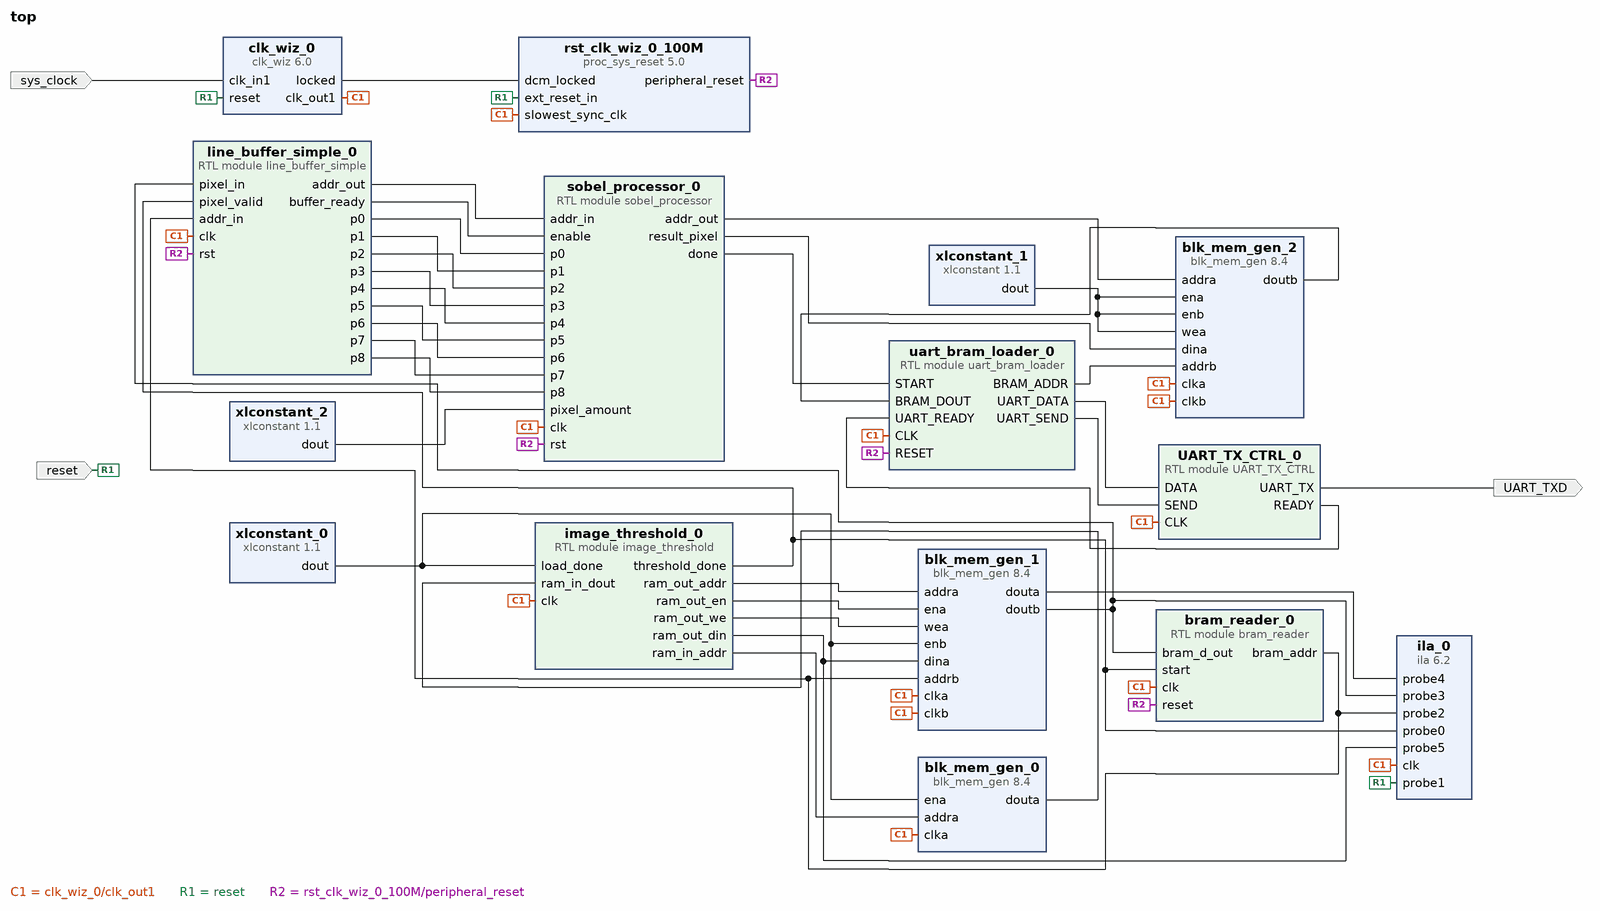
[diagram p0: block diagram of the top level]
# Vivado block design top, xc7a35tcpg236-1, Vivado 2023.2
create_bd_design top

create_bd_port -dir I -type clk sys_clock
set_property -dict {CONFIG.FREQ_HZ 100000000 CONFIG.PHASE 0.0} [get_bd_ports sys_clock]
create_bd_port -dir O UART_TXD
create_bd_port -dir I -type rst reset
set_property -dict {CONFIG.POLARITY ACTIVE_HIGH} [get_bd_ports reset]

create_bd_cell -type ip -vlnv xilinx.com:ip:clk_wiz:6.0 clk_wiz_0
set_property -dict [list \
  CONFIG.CLKOUT1_JITTER 151.636 \
  CONFIG.CLKOUT1_REQUESTED_OUT_FREQ 50 \
  CONFIG.CLK_IN1_BOARD_INTERFACE sys_clock \
  CONFIG.MMCM_CLKOUT0_DIVIDE_F 20.000 \
  CONFIG.RESET_BOARD_INTERFACE reset \
  CONFIG.USE_BOARD_FLOW true \
] [get_bd_cells clk_wiz_0]
create_bd_cell -type ip -vlnv xilinx.com:ip:blk_mem_gen:8.4 blk_mem_gen_0
set_property -dict [list \
  CONFIG.Coe_File ../../../../../../pepe_8b.coe \
  CONFIG.Load_Init_File true \
  CONFIG.Memory_Type Single_Port_ROM \
  CONFIG.Write_Depth_A 1024 \
  CONFIG.Write_Width_A 8 \
  CONFIG.use_bram_block Stand_Alone \
] [get_bd_cells blk_mem_gen_0]
create_bd_cell -type module -reference image_threshold image_threshold_0
create_bd_cell -type ip -vlnv xilinx.com:ip:blk_mem_gen:8.4 blk_mem_gen_1
set_property -dict [list \
  CONFIG.Assume_Synchronous_Clk false \
  CONFIG.Memory_Type True_Dual_Port_RAM \
  CONFIG.Use_Byte_Write_Enable false \
  CONFIG.Write_Depth_A 1024 \
  CONFIG.Write_Width_A 8 \
  CONFIG.use_bram_block Stand_Alone \
] [get_bd_cells blk_mem_gen_1]
create_bd_cell -type ip -vlnv xilinx.com:ip:proc_sys_reset:5.0 rst_clk_wiz_0_100M
set_property -dict {CONFIG.RESET_BOARD_INTERFACE reset CONFIG.USE_BOARD_FLOW true} [get_bd_cells rst_clk_wiz_0_100M]
create_bd_cell -type ip -vlnv xilinx.com:ip:xlconstant:1.1 xlconstant_0
create_bd_cell -type module -reference sobel_processor sobel_processor_0
create_bd_cell -type ip -vlnv xilinx.com:ip:xlconstant:1.1 xlconstant_2
set_property -dict {CONFIG.CONST_VAL 1023 CONFIG.CONST_WIDTH 10} [get_bd_cells xlconstant_2]
create_bd_cell -type ip -vlnv xilinx.com:ip:blk_mem_gen:8.4 blk_mem_gen_2
set_property -dict [list \
  CONFIG.Assume_Synchronous_Clk true \
  CONFIG.Enable_B Use_ENB_Pin \
  CONFIG.Memory_Type True_Dual_Port_RAM \
  CONFIG.Operating_Mode_A WRITE_FIRST \
  CONFIG.Operating_Mode_B WRITE_FIRST \
  CONFIG.Write_Depth_A 1024 \
  CONFIG.Write_Width_A 8 \
  CONFIG.use_bram_block Stand_Alone \
] [get_bd_cells blk_mem_gen_2]
create_bd_cell -type module -reference UART_TX_CTRL UART_TX_CTRL_0
create_bd_cell -type ip -vlnv xilinx.com:ip:xlconstant:1.1 xlconstant_1
create_bd_cell -type module -reference uart_bram_loader uart_bram_loader_0
create_bd_cell -type ip -vlnv xilinx.com:ip:ila:6.2 ila_0
set_property -dict [list \
  CONFIG.ALL_PROBE_SAME_MU_CNT 4 \
  CONFIG.C_DATA_DEPTH 4096 \
  CONFIG.C_MONITOR_TYPE Native \
  CONFIG.C_NUM_OF_PROBES 6 \
  CONFIG.C_PROBE2_WIDTH 10 \
  CONFIG.C_PROBE3_WIDTH 8 \
  CONFIG.C_PROBE4_WIDTH 8 \
  CONFIG.C_PROBE5_WIDTH 8 \
  CONFIG.C_PROBE6_WIDTH 1 \
  CONFIG.C_PROBE7_WIDTH 1 \
] [get_bd_cells ila_0]
create_bd_cell -type module -reference line_buffer_simple line_buffer_simple_0
create_bd_cell -type module -reference bram_reader bram_reader_0

# ---- connections ----

connect_bd_net [get_bd_pins UART_TX_CTRL_0/READY] [get_bd_pins uart_bram_loader_0/UART_READY]
connect_bd_net [get_bd_pins UART_TX_CTRL_0/UART_TX] [get_bd_ports UART_TXD]
connect_bd_net [get_bd_pins blk_mem_gen_0/douta] [get_bd_pins image_threshold_0/ram_in_dout]
connect_bd_net [get_bd_pins blk_mem_gen_1/douta] [get_bd_pins ila_0/probe4]
connect_bd_net [get_bd_pins blk_mem_gen_1/doutb] \
  [get_bd_pins ila_0/probe3] [get_bd_pins bram_reader_0/bram_d_out] [get_bd_pins line_buffer_simple_0/pixel_in]
connect_bd_net [get_bd_pins blk_mem_gen_2/doutb] [get_bd_pins uart_bram_loader_0/BRAM_DOUT]
connect_bd_net [get_bd_pins clk_wiz_0/clk_out1] \
  [get_bd_pins rst_clk_wiz_0_100M/slowest_sync_clk] [get_bd_pins blk_mem_gen_1/clkb] [get_bd_pins blk_mem_gen_1/clka] \
  [get_bd_pins blk_mem_gen_0/clka] [get_bd_pins blk_mem_gen_2/clka] [get_bd_pins blk_mem_gen_2/clkb] \
  [get_bd_pins uart_bram_loader_0/CLK] [get_bd_pins ila_0/clk] [get_bd_pins UART_TX_CTRL_0/CLK] \
  [get_bd_pins bram_reader_0/clk] [get_bd_pins line_buffer_simple_0/clk] [get_bd_pins image_threshold_0/clk] \
  [get_bd_pins sobel_processor_0/clk]
connect_bd_net [get_bd_pins clk_wiz_0/locked] [get_bd_pins rst_clk_wiz_0_100M/dcm_locked]
connect_bd_net [get_bd_pins image_threshold_0/ram_in_addr] [get_bd_pins blk_mem_gen_0/addra]
connect_bd_net [get_bd_pins image_threshold_0/ram_out_addr] [get_bd_pins blk_mem_gen_1/addra]
connect_bd_net [get_bd_pins image_threshold_0/ram_out_din] [get_bd_pins blk_mem_gen_1/dina] [get_bd_pins ila_0/probe5]
connect_bd_net [get_bd_pins image_threshold_0/ram_out_en] [get_bd_pins blk_mem_gen_1/ena]
connect_bd_net [get_bd_pins image_threshold_0/ram_out_we] [get_bd_pins blk_mem_gen_1/wea]
connect_bd_net [get_bd_pins image_threshold_0/threshold_done] \
  [get_bd_pins ila_0/probe0] [get_bd_pins bram_reader_0/start] [get_bd_pins line_buffer_simple_0/pixel_valid]
connect_bd_net [get_bd_pins line_buffer_simple_0/addr_out] [get_bd_pins sobel_processor_0/addr_in]
connect_bd_net -net line_buffer_simple_0_bram_addr [get_bd_pins bram_reader_0/bram_addr] \
  [get_bd_pins ila_0/probe2] [get_bd_pins blk_mem_gen_1/addrb] [get_bd_pins line_buffer_simple_0/addr_in]
connect_bd_net [get_bd_pins line_buffer_simple_0/buffer_ready] [get_bd_pins sobel_processor_0/enable]
connect_bd_net [get_bd_pins line_buffer_simple_0/p0] [get_bd_pins sobel_processor_0/p0]
connect_bd_net [get_bd_pins line_buffer_simple_0/p1] [get_bd_pins sobel_processor_0/p1]
connect_bd_net [get_bd_pins line_buffer_simple_0/p2] [get_bd_pins sobel_processor_0/p2]
connect_bd_net [get_bd_pins line_buffer_simple_0/p3] [get_bd_pins sobel_processor_0/p3]
connect_bd_net [get_bd_pins line_buffer_simple_0/p4] [get_bd_pins sobel_processor_0/p4]
connect_bd_net [get_bd_pins line_buffer_simple_0/p5] [get_bd_pins sobel_processor_0/p5]
connect_bd_net [get_bd_pins line_buffer_simple_0/p6] [get_bd_pins sobel_processor_0/p6]
connect_bd_net [get_bd_pins line_buffer_simple_0/p7] [get_bd_pins sobel_processor_0/p7]
connect_bd_net [get_bd_pins line_buffer_simple_0/p8] [get_bd_pins sobel_processor_0/p8]
connect_bd_net [get_bd_ports reset] [get_bd_pins rst_clk_wiz_0_100M/ext_reset_in] [get_bd_pins clk_wiz_0/reset] [get_bd_pins ila_0/probe1]
connect_bd_net [get_bd_pins rst_clk_wiz_0_100M/peripheral_reset] \
  [get_bd_pins uart_bram_loader_0/RESET] [get_bd_pins bram_reader_0/reset] [get_bd_pins line_buffer_simple_0/rst] \
  [get_bd_pins sobel_processor_0/rst]
connect_bd_net [get_bd_pins sobel_processor_0/addr_out] [get_bd_pins blk_mem_gen_2/addra]
connect_bd_net [get_bd_pins sobel_processor_0/done] [get_bd_pins uart_bram_loader_0/START]
connect_bd_net [get_bd_pins sobel_processor_0/result_pixel] [get_bd_pins blk_mem_gen_2/dina]
connect_bd_net [get_bd_ports sys_clock] [get_bd_pins clk_wiz_0/clk_in1]
connect_bd_net [get_bd_pins uart_bram_loader_0/BRAM_ADDR] [get_bd_pins blk_mem_gen_2/addrb]
connect_bd_net [get_bd_pins uart_bram_loader_0/UART_DATA] [get_bd_pins UART_TX_CTRL_0/DATA]
connect_bd_net [get_bd_pins uart_bram_loader_0/UART_SEND] [get_bd_pins UART_TX_CTRL_0/SEND]
connect_bd_net [get_bd_pins xlconstant_0/dout] \
  [get_bd_pins blk_mem_gen_0/ena] [get_bd_pins blk_mem_gen_1/enb] [get_bd_pins image_threshold_0/load_done]
connect_bd_net [get_bd_pins xlconstant_1/dout] [get_bd_pins blk_mem_gen_2/ena] [get_bd_pins blk_mem_gen_2/enb] [get_bd_pins blk_mem_gen_2/wea]
connect_bd_net [get_bd_pins xlconstant_2/dout] [get_bd_pins sobel_processor_0/pixel_amount]

set_property USER_COMMENTS.comment_0 {1. ROM with COE loading.} [current_bd_design]
set_property USER_COMMENTS.comment_1 {2. Threshold Reading 
then storing in RAM} [current_bd_design]
set_property USER_COMMENTS.comment_2 {3. RAM with
Image threshold pixels} [current_bd_design]
set_property USER_COMMENTS.comment_4 {4. Line Buffer for Kernal} [current_bd_design]
set_property USER_COMMENTS.comment_5 {5. Sobel Processing} [current_bd_design]
set_property USER_COMMENTS.comment_6 {6. Sobel Processing stored in seperate RAM} [current_bd_design]
set_property USER_COMMENTS.comment_7 {7. UART Streaming.} [current_bd_design]

validate_bd_design
save_bd_design
